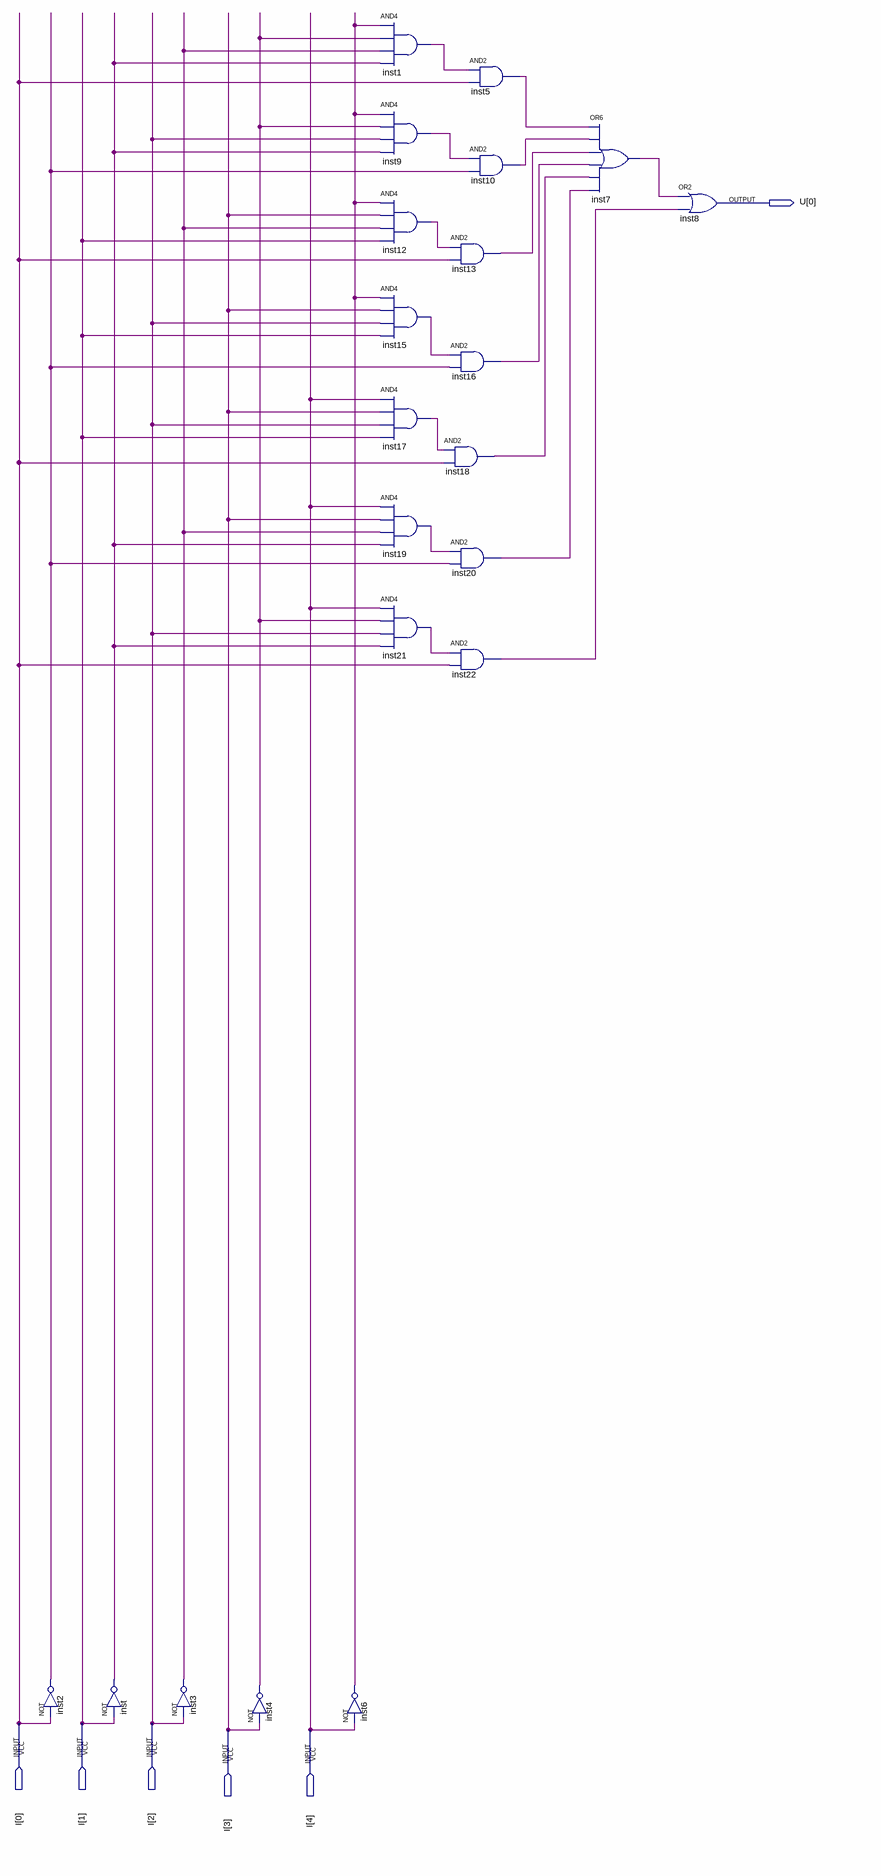
[diagram p0: schematic sheet]
// Quartus schematic BCD_a_Segment.bdf as structural Verilog: 21 symbols, 6 pins
module BCD_a_Segment (
  input  [4:0] I,
  output [0:0] U
);

  wire inst1_out, inst2_out, inst3_out, inst4_out, inst5_out, inst6_out, inst7_out, inst9_out, inst10_out,
       inst12_out, inst13_out, inst15_out, inst16_out, inst17_out, inst18_out, inst19_out, inst20_out,
       inst21_out, inst22_out, inst_out;

  not inst2 (inst2_out, I[0]);
  not inst (inst_out, I[1]);
  not inst3 (inst3_out, I[2]);
  not inst4 (inst4_out, I[3]);
  not inst6 (inst6_out, I[4]);
  and inst1 (inst1_out, inst6_out, inst4_out, inst3_out, inst_out);
  and inst9 (inst9_out, inst6_out, inst4_out, I[2], inst_out);
  and inst12 (inst12_out, inst6_out, I[3], inst3_out, I[1]);
  and inst15 (inst15_out, inst6_out, I[3], I[2], I[1]);
  and inst17 (inst17_out, I[4], I[3], I[2], I[1]);
  and inst19 (inst19_out, I[4], I[3], inst3_out, inst_out);
  and inst21 (inst21_out, I[4], inst4_out, I[2], inst_out);
  and inst13 (inst13_out, inst12_out, I[0]);
  and inst16 (inst16_out, inst15_out, inst2_out);
  and inst18 (inst18_out, inst17_out, I[0]);
  and inst20 (inst20_out, inst19_out, inst2_out);
  and inst22 (inst22_out, inst21_out, I[0]);
  and inst5 (inst5_out, inst1_out, I[0]);
  and inst10 (inst10_out, inst9_out, inst2_out);
  or inst7 (inst7_out, inst5_out, inst10_out, inst13_out, inst16_out, inst18_out, inst20_out);
  or inst8 (U[0], inst7_out, inst22_out);
endmodule
